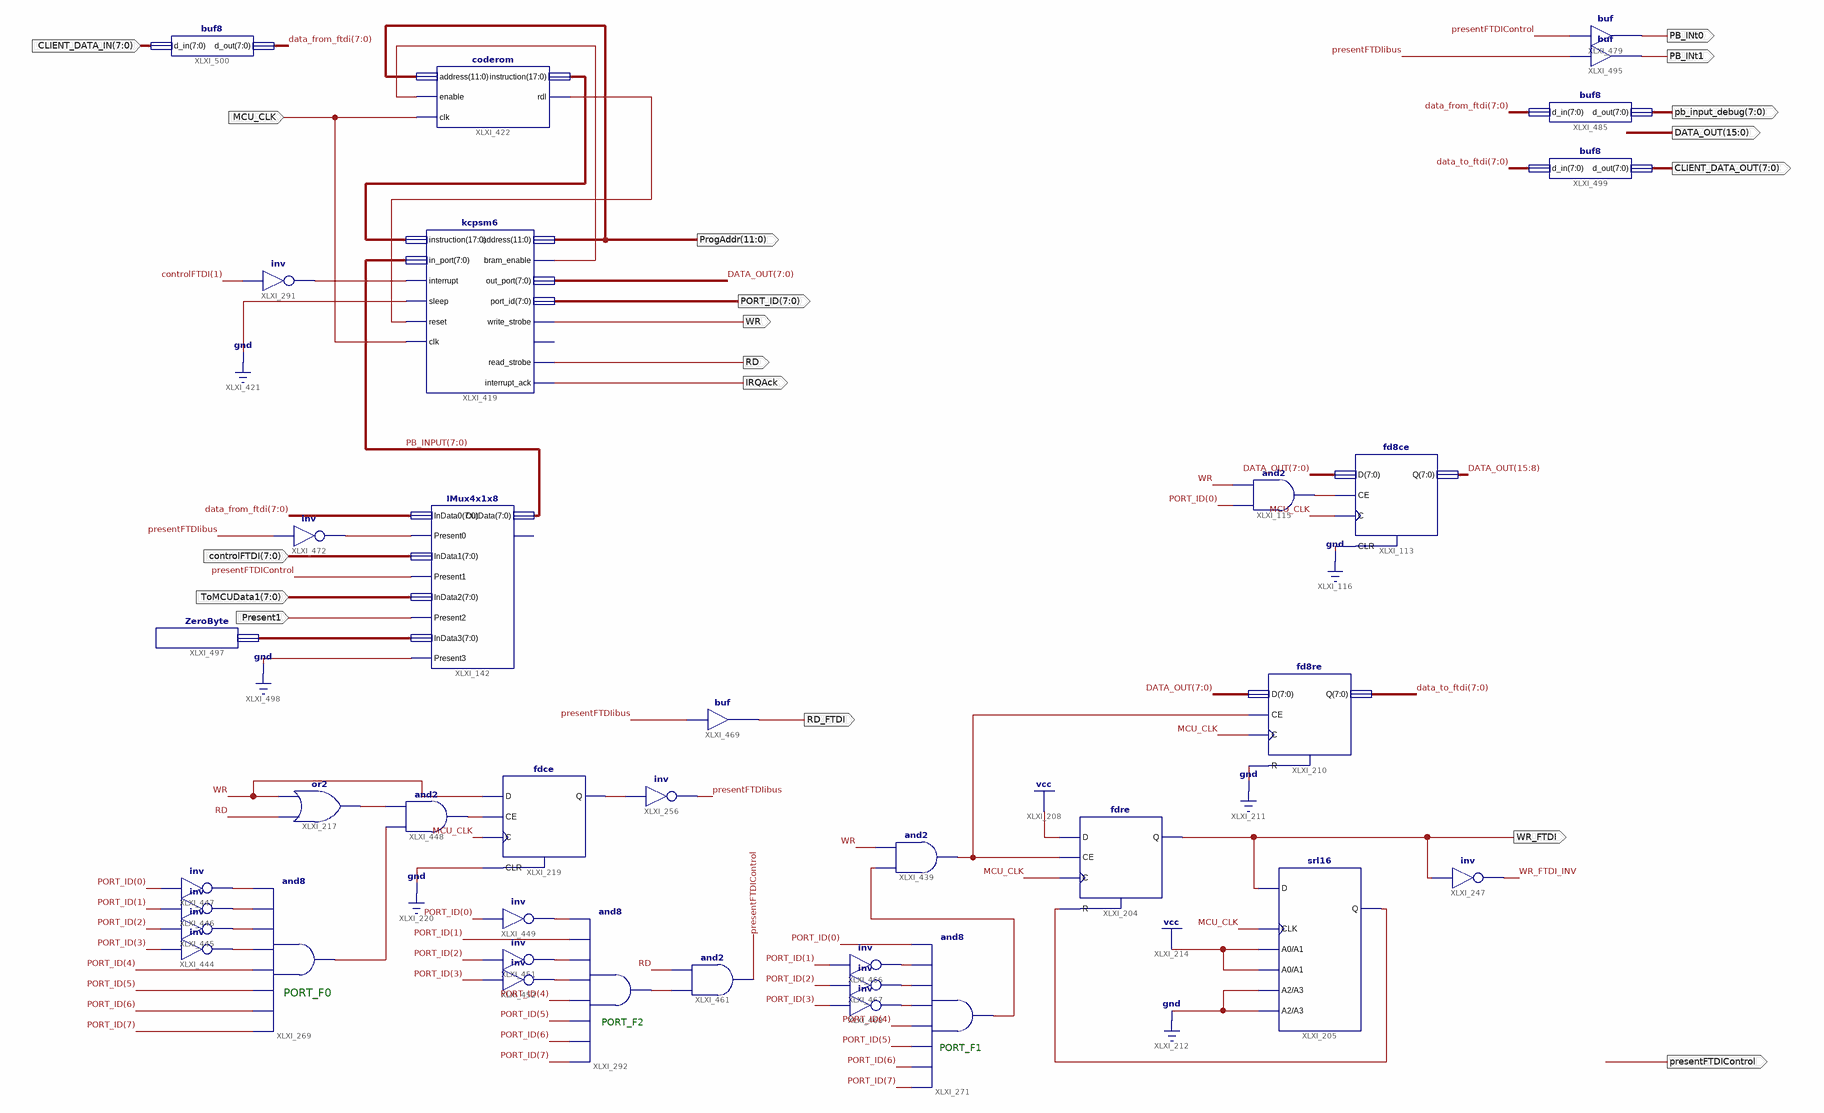
[diagram p0: schematic sheet 1]
// Xilinx ISE schematic PicoblazeInterface.sch (spartan6) as structural Verilog: 37 symbols, 19 ports
module PicoblazeInterface (
  input  MCU_CLK,
  input  Present1,
  input  [7:0] ToMCUData1,
  input  [7:0] controlFTDI,
  input  [7:0] CLIENT_DATA_IN,
  output WR,
  output RD,
  output [11:0] ProgAddr,
  output presentFTDIControl,
  output RD_FTDI,
  output WR_FTDI,
  output [7:0] data_to_ftdi,
  output IRQAck,
  output [7:0] PORT_ID,
  output PB_INt0,
  output [7:0] pb_input_debug,
  output [15:0] DATA_OUT,
  output PB_INt1,
  output [7:0] CLIENT_DATA_OUT
);

  wire just_some_net, presentFTDIibus, presentInFTDI1, WR_FTDI_INV, XLXN_215, XLXN_501, XLXN_536, XLXN_541,
       XLXN_633, XLXN_644, XLXN_723, XLXN_1090, XLXN_1091, XLXN_1112, XLXN_1113, XLXN_1114, XLXN_1115,
       XLXN_1120, XLXN_1122, XLXN_1123, XLXN_1154, XLXN_1161, XLXN_1162, XLXN_1163, XLXN_1164;
  wire [7:0] data_from_ftdi, PB_INPUT, XLXN_1237;
  wire [17:0] XLXN_1;

  fdce XLXI_219 (.C(MCU_CLK), .CE(XLXN_541), .CLR(1'b0), .D(WR), .Q(XLXN_644));
  not XLXI_256 (presentFTDIibus, XLXN_644);
  or XLXI_217 (XLXN_536, RD, WR);
  and XLXI_269 (just_some_net, PORT_ID[7], PORT_ID[6], PORT_ID[5], PORT_ID[4], XLXN_1115, XLXN_1114, XLXN_1113, XLXN_1112);
  and XLXI_292 (XLXN_1154, PORT_ID[7], PORT_ID[6], PORT_ID[5], PORT_ID[4], XLXN_1123, XLXN_1122, PORT_ID[1], XLXN_1120);
  srl16 XLXI_205 (.A0(1'b1), .A1(1'b1), .A2(1'b0), .A3(1'b0), .CLK(MCU_CLK), .D(WR_FTDI), .Q(XLXN_501));
  fdre XLXI_204 (.C(MCU_CLK), .CE(presentInFTDI1), .D(1'b1), .R(XLXN_501), .Q(WR_FTDI));
  fd8re XLXI_210 (.C(MCU_CLK), .CE(presentInFTDI1), .D(DATA_OUT[7:0]), .R(1'b0), .Q(data_to_ftdi));
  not XLXI_247 (WR_FTDI_INV, WR_FTDI);
  and XLXI_115 (XLXN_215, PORT_ID[0], WR);
  fd8ce XLXI_113 (.C(MCU_CLK), .CE(XLXN_215), .CLR(1'b0), .D(DATA_OUT[7:0]), .Q(DATA_OUT[15:8]));
  IMux4x1x8 XLXI_142 (
    .InData0(data_from_ftdi), .InData1(controlFTDI), .InData2(ToMCUData1), .InData3(XLXN_1237),
    .Present3(1'b0), .Present2(Present1), .Present1(presentFTDIControl), .Present0(XLXN_1164),
    .OutData(PB_INPUT));  // open: Present
  not XLXI_291 (XLXN_723, controlFTDI[1]);
  kcpsm6 XLXI_419 (
    .instruction(XLXN_1), .in_port(PB_INPUT), .interrupt(XLXN_723), .sleep(1'b0), .reset(XLXN_1091),
    .clk(MCU_CLK), .address(ProgAddr), .bram_enable(XLXN_1090), .out_port(DATA_OUT[7:0]), .port_id(PORT_ID),
    .write_strobe(WR), .read_strobe(RD), .interrupt_ack(IRQAck));  // open: k_write_strobe
  coderom XLXI_422 (.address(ProgAddr), .enable(XLXN_1090), .clk(MCU_CLK), .instruction(XLXN_1), .rdl(XLXN_1091));
  and XLXI_439 (presentInFTDI1, XLXN_633, WR);
  not XLXI_444 (XLXN_1115, PORT_ID[3]);
  not XLXI_445 (XLXN_1114, PORT_ID[2]);
  not XLXI_446 (XLXN_1113, PORT_ID[1]);
  not XLXI_447 (XLXN_1112, PORT_ID[0]);
  and XLXI_448 (XLXN_541, just_some_net, XLXN_536);
  not XLXI_449 (XLXN_1120, PORT_ID[0]);
  not XLXI_451 (XLXN_1122, PORT_ID[2]);
  not XLXI_452 (XLXN_1123, PORT_ID[3]);
  and XLXI_271 (XLXN_633, PORT_ID[7], PORT_ID[6], PORT_ID[5], PORT_ID[4], XLXN_1163, XLXN_1162, XLXN_1161, PORT_ID[0]);
  and XLXI_461 (presentFTDIControl, XLXN_1154, RD);
  not XLXI_466 (XLXN_1161, PORT_ID[1]);
  not XLXI_467 (XLXN_1162, PORT_ID[2]);
  not XLXI_468 (XLXN_1163, PORT_ID[3]);
  buf XLXI_469 (RD_FTDI, presentFTDIibus);
  not XLXI_472 (XLXN_1164, presentFTDIibus);
  buf XLXI_479 (PB_INt0, presentFTDIControl);
  buf8 XLXI_485 (.d_in(data_from_ftdi), .d_out(pb_input_debug));
  buf XLXI_495 (PB_INt1, presentFTDIibus);
  ZeroByte XLXI_497 (.ZeroData(XLXN_1237));
  buf8 XLXI_499 (.d_in(data_to_ftdi), .d_out(CLIENT_DATA_OUT));
  buf8 XLXI_500 (.d_in(CLIENT_DATA_IN), .d_out(data_from_ftdi));

  // Notes on the sheet:
  //   PORT_F0
  //   PORT_F2
  //   PORT_F1
endmodule
